# Altium schematic sheet USB键盘.SchDoc
size A3
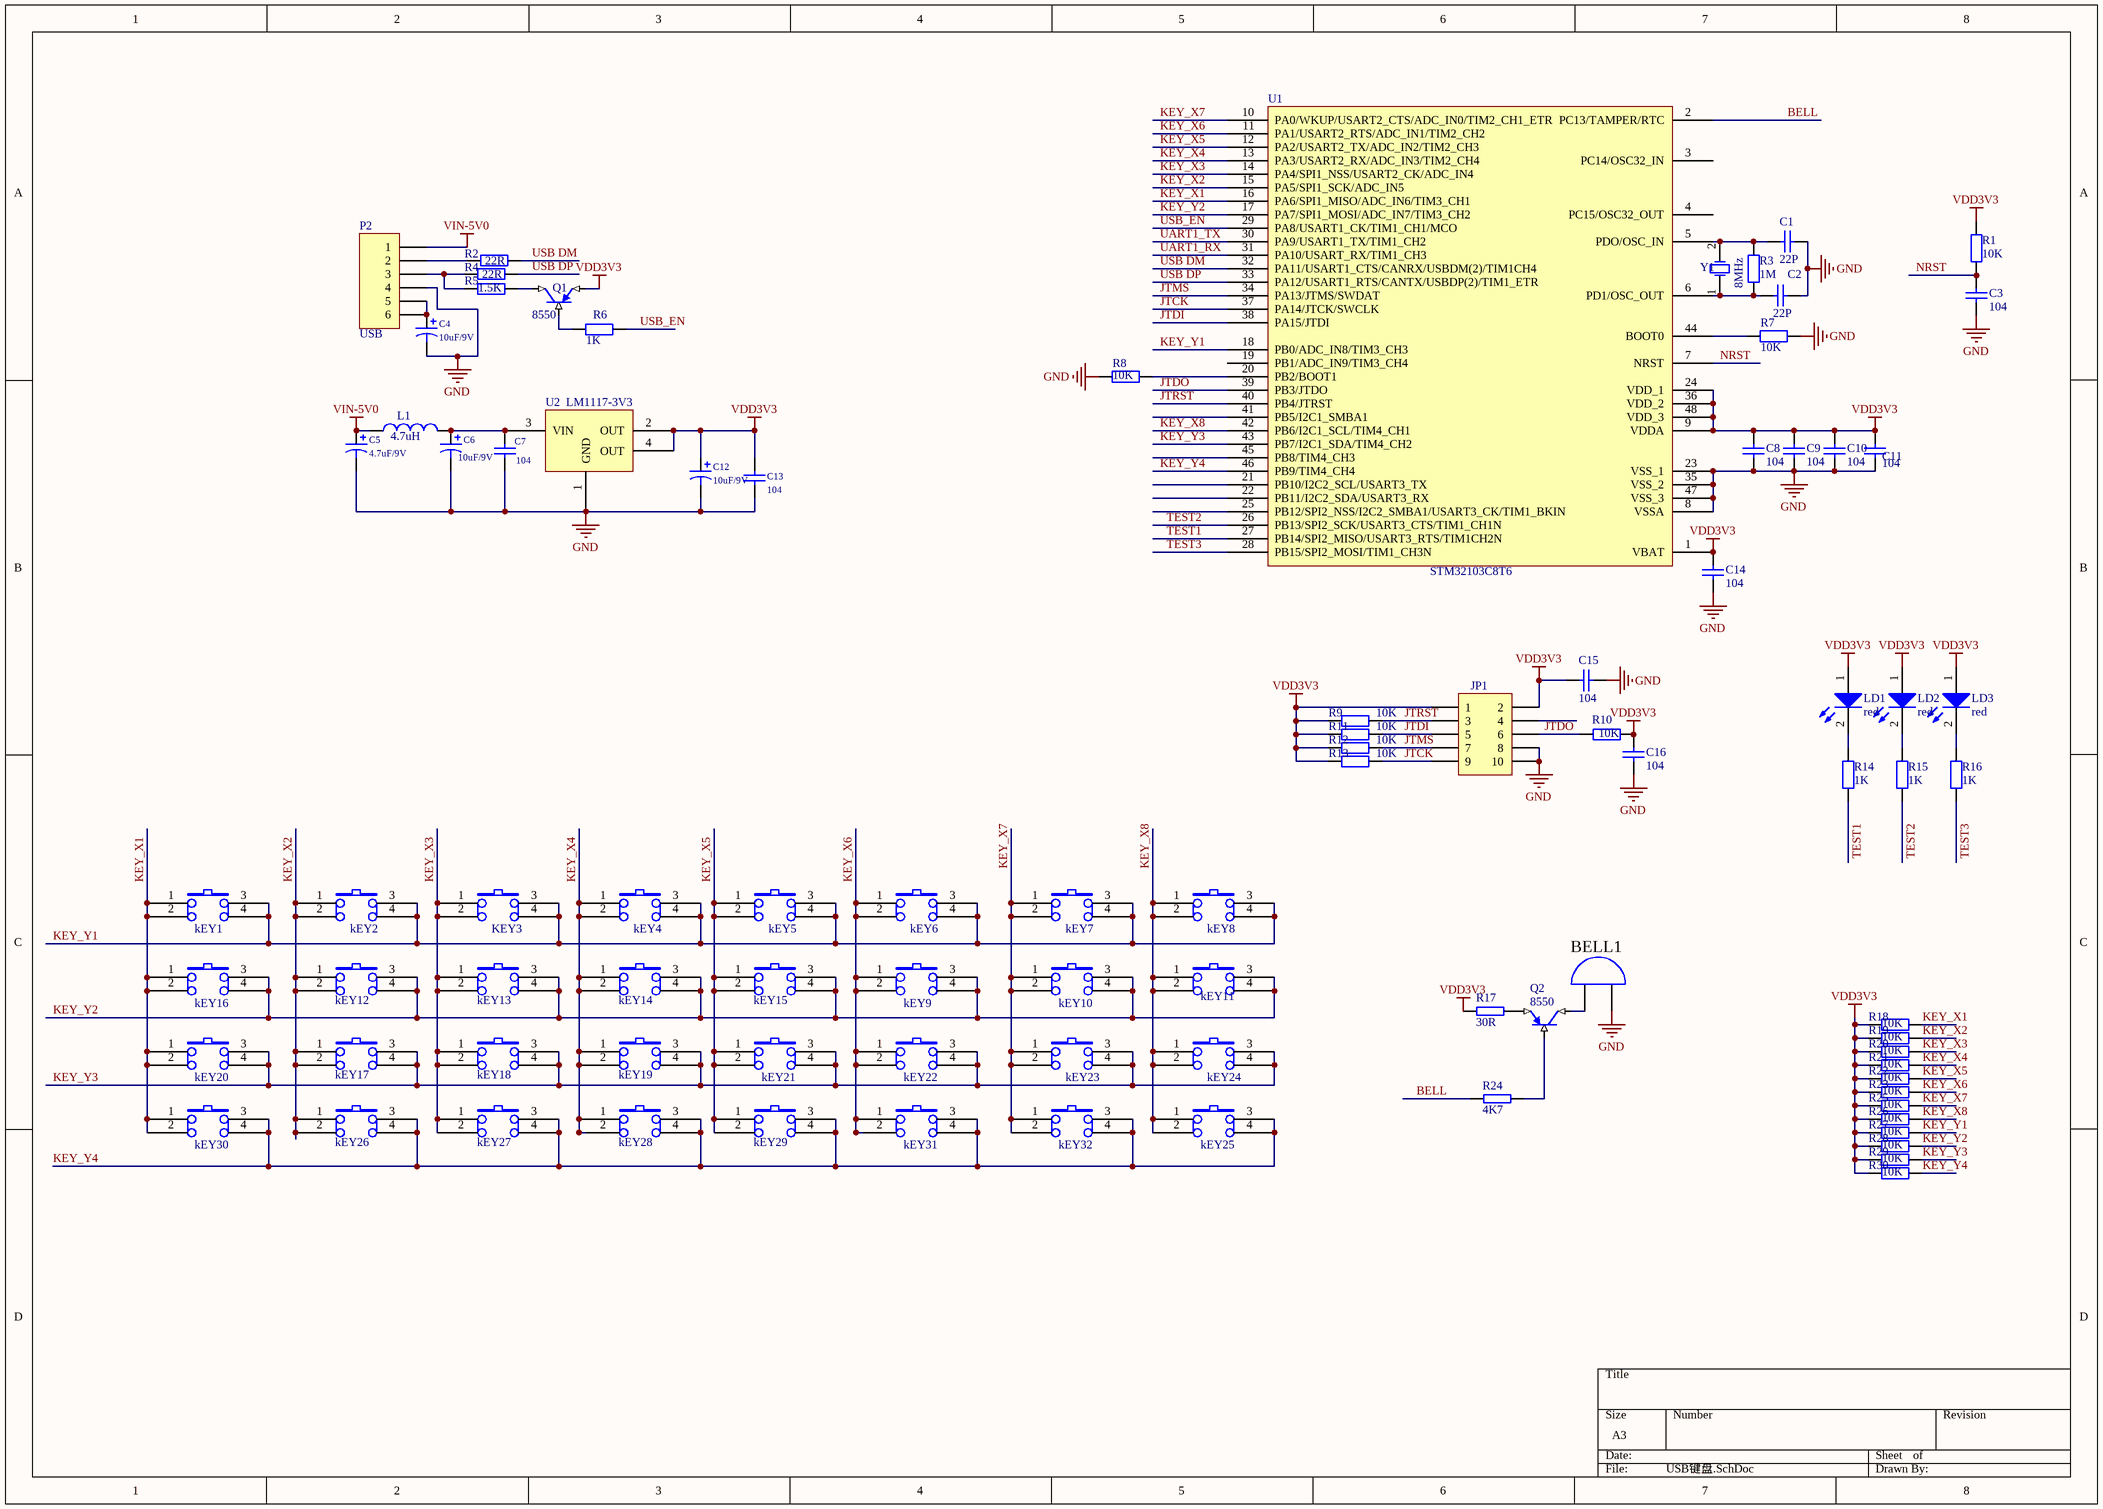
[diagram p0: USB键盘.SchDoc]

## Parts
BELL1  JIAO1  [BELL]  (value not drawn)
C1  22P  [SMD-0805]
C2  22P  [SMD-0805]
C3  104  [SMD-0805]
C4  10uF/9V  [SMD-3528]
C5  4.7uF/9V  [SMD-3528]
C6  10uF/9V  [SMD-3528]
C7  104  [SMD-0805]
C8  104  [SMD-0805]
C9  104  [SMD-0805]
C10  104  [SMD-0805]
C11  104  [SMD-0805]
C12  10uF/9V  [SMD-3528]
C13  104  [SMD-0805]
C14  104  [SMD-0805]
C15  104  [SMD-0805]
C16  104  [SMD-0805]
JP1  (no value)  [JTAG(2.0mm)]
kEY1  (no value)  [4-16mm-A]
kEY2  (no value)  [4-16mm-A]
KEY3  (no value)  [4-16mm-A]
kEY4  (no value)  [4-16mm-A]
kEY5  (no value)  [4-16mm-A]
kEY6  (no value)  [4-16mm-A]
kEY7  (no value)  [4-16mm-A]
kEY8  (no value)  [4-16mm-A]
kEY9  (no value)  [4-16mm-A]
kEY10  (no value)  [4-16mm-A]
kEY11  (no value)  [4-16mm-A]
kEY12  (no value)  [4-16mm-A]
kEY13  (no value)  [4-16mm-A]
kEY14  (no value)  [4-16mm-A]
kEY15  (no value)  [4-16mm-A]
kEY16  (no value)  [4-16mm-A]
kEY17  (no value)  [4-16mm-A]
kEY18  (no value)  [4-16mm-A]
kEY19  (no value)  [4-16mm-A]
kEY20  (no value)  [4-16mm-A]
kEY21  (no value)  [4-16mm-A]
kEY22  (no value)  [4-16mm-A]
kEY23  (no value)  [4-16mm-A]
kEY24  (no value)  [4-16mm-A]
kEY25  (no value)  [4-16mm-A]
kEY26  (no value)  [4-16mm-A]
kEY27  (no value)  [4-16mm-A]
kEY28  (no value)  [4-16mm-A]
kEY29  (no value)  [4-16mm-A]
kEY30  (no value)  [4-16mm-A]
kEY31  (no value)  [4-16mm-A]
kEY32  (no value)  [4-16mm-A]
L1  4.7uH  [SMD-0805]
LD1  red  [SMD-LED]
LD2  red  [SMD-LED]
LD3  red  [SMD-LED]
P2  USB  [USB-A]
Q1  8550  [SOT-23]
Q2  8550  [SOT-23]
R1  10K  [SMD-0805]
R2  22R  [SMD-0805]
R3  1M  [SMD-0805]
R4  22R  [SMD-0805]
R5  1.5K  [SMD-0805]
R6  1K  [SMD-0805]
R7  10K  [SMD-0805]
R8  10K  [SMD-0805]
R9  10K  [SMD-0805]
R10  10K  [SMD-0805]
R11  10K  [SMD-0805]
R12  10K  [SMD-0805]
R13  10K  [SMD-0805]
R14  1K  [SMD-0805]
R15  1K  [SMD-0805]
R16  1K  [SMD-0805]
R17  30R  [SMD-0805]
R18  10K  [SMD-0805]
R19  10K  [SMD-0805]
R20  10K  [SMD-0805]
R21  10K  [SMD-0805]
R22  10K  [SMD-0805]
R23  10K  [SMD-0805]
R24  4K7  [SMD-0805]
R25  10K  [SMD-0805]
R26  10K  [SMD-0805]
R27  10K  [SMD-0805]
R28  10K  [SMD-0805]
R29  10K  [SMD-0805]
R30  10K  [SMD-0805]
U1  STM32103C8T6  [LQFP-48]
U2  LM1117-3V3  [SOT-233]
Y1  8MHz  [XTLA]

## Nets
GND: BELL1.2(B) C1.2 C2.2 C3.1 C4.2 C5.2 C6.2 C7.1 C8.1 C9.1 C10.1 C11.1 C12.2 C13.2 C14.1 C15.1 C16.1 JP1.8 JP1.10 P2.4 R7.1 R8.2 U1.8(VSSA) U1.23(VSS_1) U1.35(VSS_2) U1.47(VSS_3) U2.1(GND)
VDD3V3: C8.2 C9.2 C10.2 C11.2 C12.1 C13.1 C14.2 C15.2 C16.2 JP1.1 JP1.2 LD1.1(A) LD2.1(A) LD3.1(A) Q1.2(E) R1.2 R9.2 R10.1 R11.2 R12.2 R13.2 R17.2 R18.1 R19.1 R20.1 R21.1 R22.1 R23.1 R25.1 R26.1 R27.1 R28.1 R29.1 R30.1 U1.1(VBAT) U1.9(VDDA) U1.24(VDD_1) U1.36(VDD_2) U1.48(VDD_3) U2.2(OUT) U2.4(OUT)
VIN-5V0: C5.1 L1.2 P2.1
BELL: R24.2 U1.2(PC13/TAMPER/RTC)
JTCK: JP1.9 R13.1 U1.37(PA14/JTCK/SWCLK)
JTDI: JP1.5 R11.1 U1.38(PA15/JTDI)
JTDO: JP1.6 R10.2 U1.39(PB3/JTDO)
JTMS: JP1.7 R12.1 U1.34(PA13/JTMS/SWDAT)
JTRST: JP1.3 R9.1 U1.40(PB4/JTRST)
KEY_X1: kEY1.1 kEY1.2 kEY16.1 kEY16.2 kEY20.1 kEY20.2 kEY30.1 kEY30.2 R18.2 U1.16(PA6/SPI1_MISO/ADC_IN6/TIM3_CH1)
KEY_X2: kEY2.1 kEY2.2 kEY12.1 kEY12.2 kEY17.1 kEY17.2 kEY26.1 kEY26.2 R19.2 U1.15(PA5/SPI1_SCK/ADC_IN5)
KEY_X3: KEY3.1 KEY3.2 kEY13.1 kEY13.2 kEY18.1 kEY18.2 kEY27.1 kEY27.2 R20.2 U1.14(PA4/SPI1_NSS/USART2_CK/ADC_IN4)
KEY_X4: kEY4.1 kEY4.2 kEY14.1 kEY14.2 kEY19.1 kEY19.2 kEY28.1 kEY28.2 R21.2 U1.13(PA3/USART2_RX/ADC_IN3/TIM2_CH4)
KEY_X5: kEY5.1 kEY5.2 kEY15.1 kEY15.2 kEY21.1 kEY21.2 kEY29.1 kEY29.2 R22.2 U1.12(PA2/USART2_TX/ADC_IN2/TIM2_CH3)
KEY_X6: kEY6.1 kEY6.2 kEY9.1 kEY9.2 kEY22.1 kEY22.2 kEY31.1 kEY31.2 R23.2 U1.11(PA1/USART2_RTS/ADC_IN1/TIM2_CH2)
KEY_X7: kEY7.1 kEY7.2 kEY10.1 kEY10.2 kEY23.1 kEY23.2 kEY32.1 kEY32.2 R25.2 U1.10(PA0/WKUP/USART2_CTS/ADC_IN0/TIM2_CH1_ETR)
KEY_X8: kEY8.1 kEY8.2 kEY11.1 kEY11.2 kEY24.1 kEY24.2 kEY25.1 kEY25.2 R26.2 U1.42(PB6/I2C1_SCL/TIM4_CH1)
KEY_Y1: kEY1.3 kEY1.4 kEY2.3 kEY2.4 KEY3.3 KEY3.4 kEY4.3 kEY4.4 kEY5.3 kEY5.4 kEY6.3 kEY6.4 kEY7.3 kEY7.4 kEY8.3 kEY8.4 R27.2 U1.18(PB0/ADC_IN8/TIM3_CH3)
KEY_Y2: kEY9.3 kEY9.4 kEY10.3 kEY10.4 kEY11.3 kEY11.4 kEY12.3 kEY12.4 kEY13.3 kEY13.4 kEY14.3 kEY14.4 kEY15.3 kEY15.4 kEY16.3 kEY16.4 R28.2 U1.17(PA7/SPI1_MOSI/ADC_IN7/TIM3_CH2)
KEY_Y3: kEY17.3 kEY17.4 kEY18.3 kEY18.4 kEY19.3 kEY19.4 kEY20.3 kEY20.4 kEY21.3 kEY21.4 kEY22.3 kEY22.4 kEY23.3 kEY23.4 kEY24.3 kEY24.4 R29.2 U1.43(PB7/I2C1_SDA/TIM4_CH2)
KEY_Y4: kEY25.3 kEY25.4 kEY26.3 kEY26.4 kEY27.3 kEY27.4 kEY28.3 kEY28.4 kEY29.3 kEY29.4 kEY30.3 kEY30.4 kEY31.3 kEY31.4 kEY32.3 kEY32.4 R30.2 U1.46(PB9/TIM4_CH4)
NRST: C3.2 R1.1 U1.7(NRST)
TEST1: R14.2 U1.27(PB14/SPI2_MISO/USART3_RTS/TIM1CH2N)
TEST2: R15.2 U1.26(PB13/SPI2_SCK/USART3_CTS/TIM1_CH1N)
TEST3: R16.2 U1.28(PB15/SPI2_MOSI/TIM1_CH3N)
UART1_RX: U1.31(PA10/USART_RX/TIM1_CH3)
UART1_TX: U1.30(PA9/USART1_TX/TIM1_CH2)
USB DM: R2.2 U1.32(PA11/USART1_CTS/CANRX/USBDM(2)/TIM1CH4)
USB DP: R4.2 U1.33(PA12/USART1_RTS/CANTX/USBDP(2)/TIM1_ETR)
USB_EN: R6.2 U1.29(PA8/USART1_CK/TIM1_CH1/MCO)
NetBELL1_1: BELL1.1(A) Q2.3(C)
NetC1_1: C1.1 R3.2 U1.5(PDO/OSC_IN) Y1.2(OSC2)
NetC2_1: C2.1 R3.1 U1.6(PD1/OSC_OUT) Y1.1(OSC1)
NetC4_1: C4.1 P2.5 P2.6
NetC6_1: C6.1 C7.2 L1.1 U2.3(VIN)
NetLD1_2: LD1.2(K) R14.1
NetLD2_2: LD2.2(K) R15.1
NetLD3_2: LD3.2(K) R16.1
NetP2_2: P2.2 R2.1
NetP2_3: P2.3 R4.1 R5.1
NetQ1_1: Q1.1(B) R6.1
NetQ1_3: Q1.3(C) R5.2
NetQ2_1: Q2.1(B) R24.1
NetQ2_2: Q2.2(E) R17.1
NetR7_2: R7.2 U1.44(BOOT0)
NetR8_1: R8.1 U1.20(PB2/BOOT1)

Not connected (* = marked no-connect by the designer): JP1 4; U1 3(PC14/OSC32_IN) 4(PC15/OSC32_OUT) 19(PB1/ADC_IN9/TIM3_CH4) 21(PB10/I2C2_SCL/USART3_TX) 22(PB11/I2C2_SDA/USART3_RX) 25(PB12/SPI2_NSS/I2C2_SMBA1/USART3_CK/TIM1_BKIN) 41(PB5/I2C1_SMBA1) 45(PB8/TIM4_CH3)

## Library data of the parts
BELL1 = BELL
C1-C3 C8-C11 C14 = Cap: Capacitor; Value: 0.1uF; Published: 8-Jun-2000; LatestRevisionDate: 17-Jul-2002; LatestRevisionNote: Re-released for DXP Platform.; PackageReference: RAD-0.3; Publisher: Altium Limited
C4-C6 C12 = Cap Pol1: Polarized Capacitor (Radial); Published: 8-Jun-2000; LatestRevisionDate: 17-Jul-2002; LatestRevisionNote: Re-released for DXP Platform.; Publisher: Altium Limited
C7 C13 C15 C16 = Cap: Capacitor; Published: 8-Jun-2000; Publisher: Altium Limited
  C7 C13: LatestRevisionDate: 17-Jul-2002; LatestRevisionNote: Re-released for DXP Platform.
  C15 C16: Revision: July-2002: Re-released for DXP Platform.; Value: 104
JP1 = Header 5X2: Header, 5-Pin, Dual row; Revision: 17-Jul-2002: Re-released for DXP Platform.; Publisher: Altium Limited
kEY1 kEY2 KEY3 kEY4-kEY32 = sw push
L1 = Inductor: Value: 100uH; Published: 8-Jun-2000; Revision: July-2002: Re-released for DXP Platform.; Publisher: Altium Limited
LD1-LD3 = LED2: Typical RED, GREEN, YELLOW, AMBER GaAs LED; Published: *; Revision: *; Publisher: *
P2 = Header 6: Header, 6-Pin; LatestRevisionDate: 17-Jul-2002; LatestRevisionNote: Re-released for DXP Platform.; Publisher: Altium Limited
Q1 Q2 = 8550: PNP BJT
R1-R5 R7-R13 R18-R23 R25-R30 = Res2: Resistor; Value: 1K; Published: 8-Jun-2000; LatestRevisionDate: 17-Jul-2002; LatestRevisionNote: Re-released for DXP Platform.; PackageReference: AXIAL-0.4; Publisher: Altium Limited
R6 R14-R16 = Res2: Resistor; Published: 8-Jun-2000; LatestRevisionDate: 17-Jul-2002; LatestRevisionNote: Re-released for DXP Platform.; PackageReference: AXIAL-0.4; Publisher: Altium Limited; Value: 1K
R17 R24 = RES
U2 = LM1117
Y1 = XTAL: 晶体振荡器; Published: 8-Jun-2000; Revision: July-2002: Re-released for DXP Platform.; Publisher: Altium Limited